# EAGLE design IRCHR_CTRL_J002942REVB (EAGLE 7.7.0)
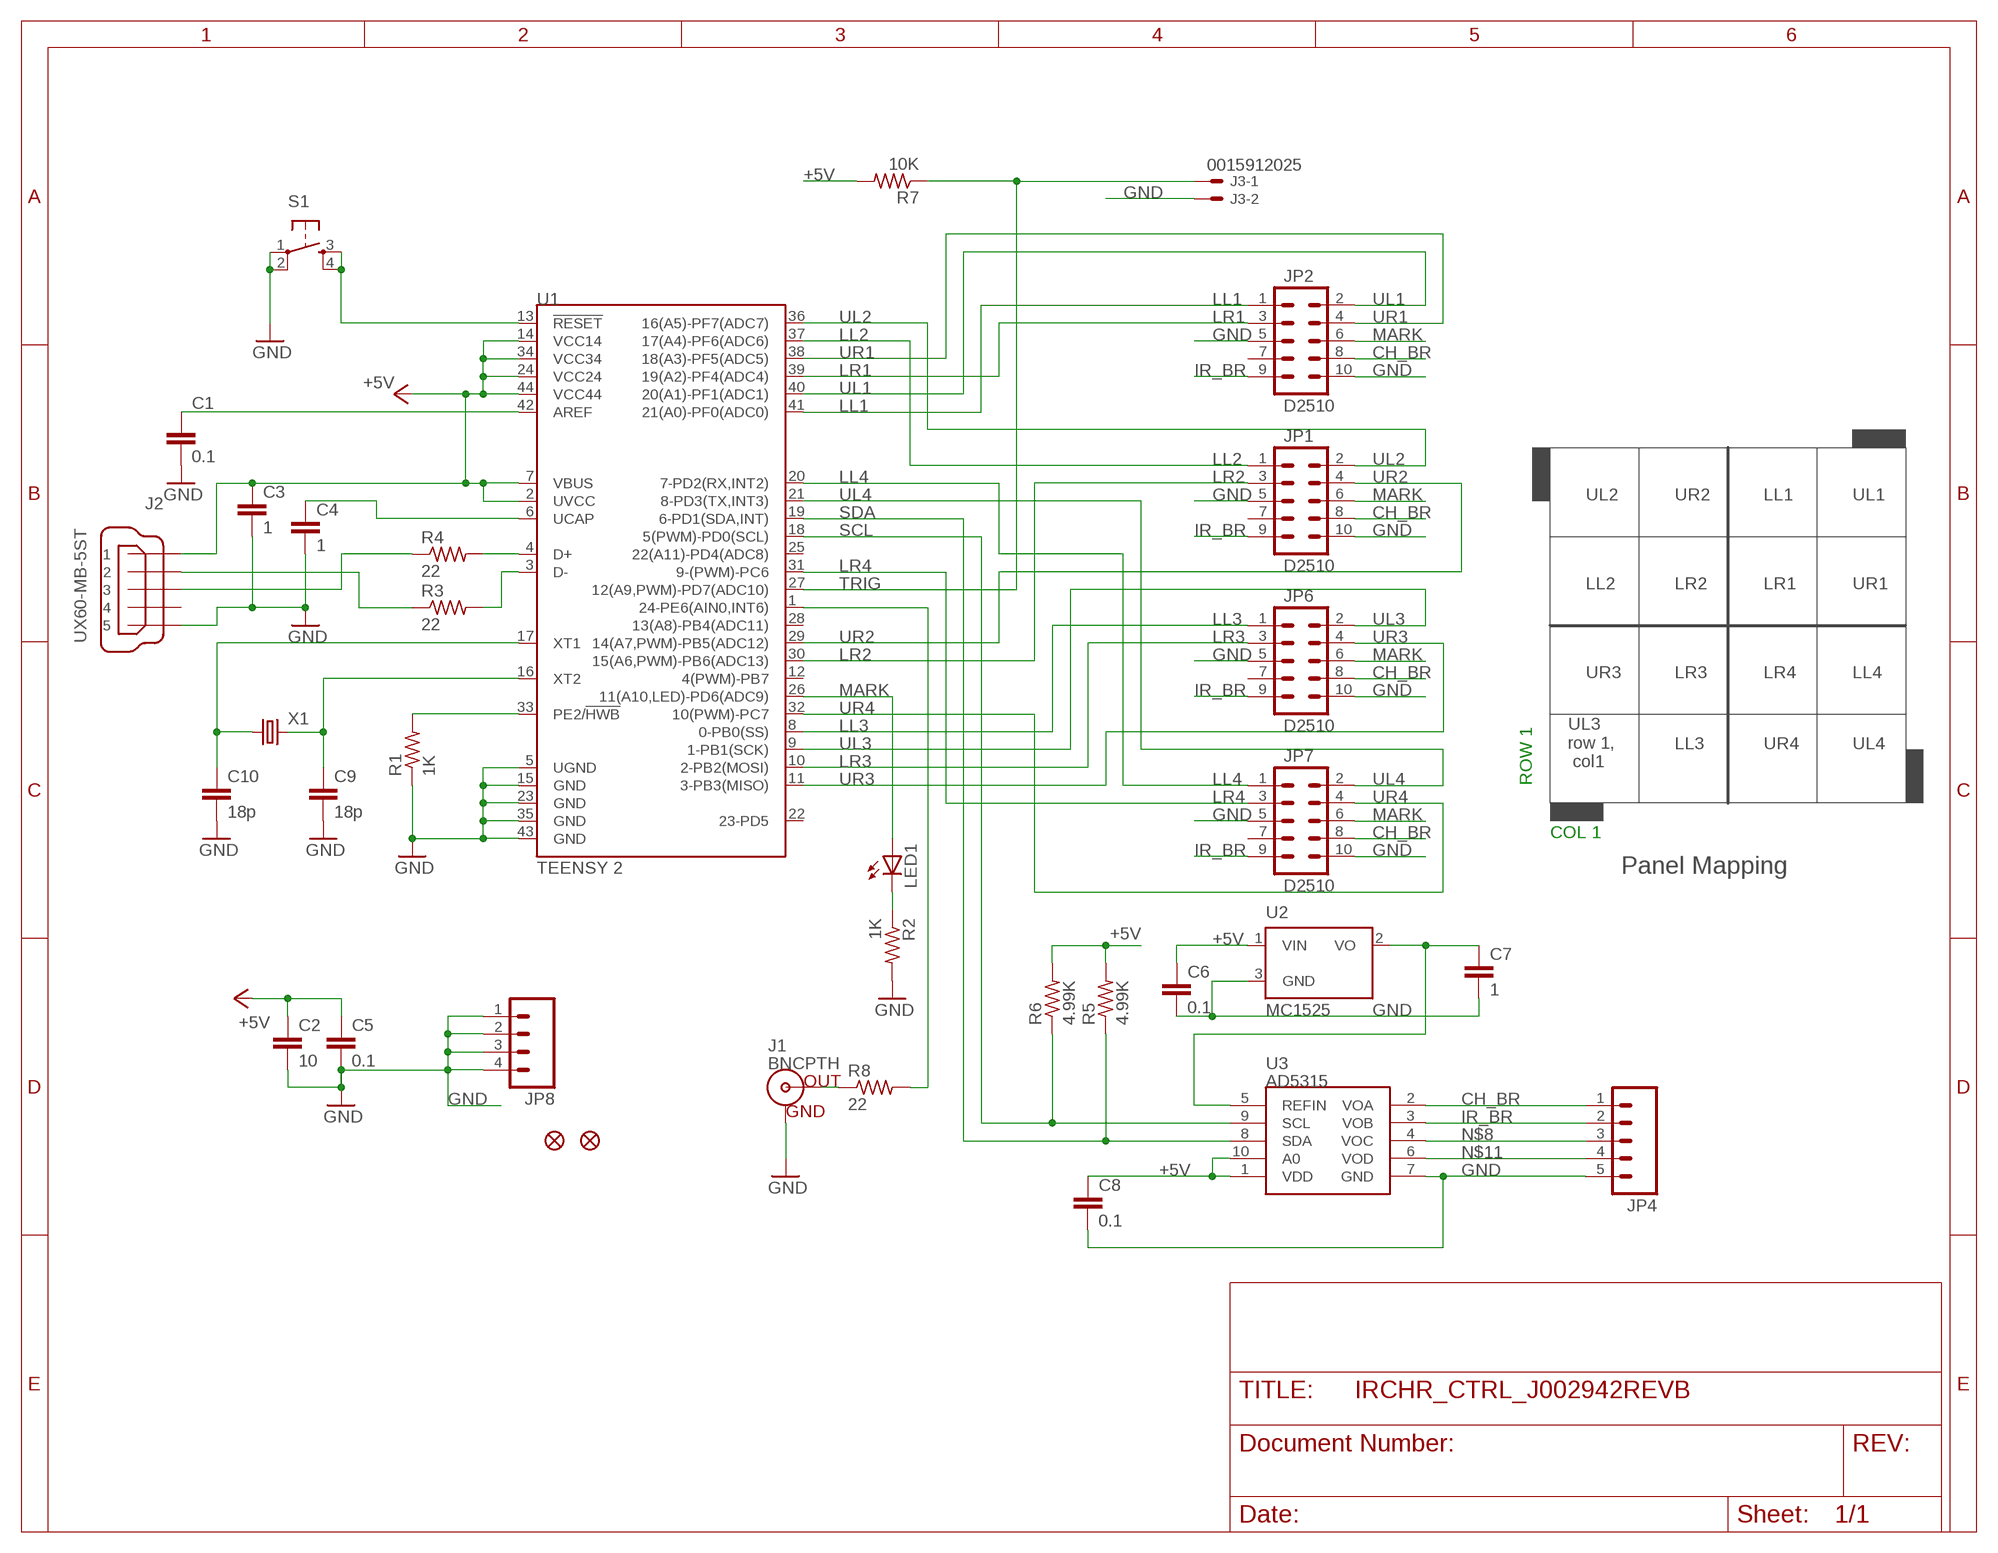
[diagram p0: schematic, sheet 1]

## Parts
C1  0.1  CAPS0805S  [0805S]
C2  10  CAPS1206S  [1206S]
C3  1  CAPS0805S  [0805S]
C4  1  CAPS0805S  [0805S]
C5  0.1  CAPS0805S  [0805S]
C6  0.1  CAPS0805S  [0805S]
C7  1  CAPS0805S  [0805S]
C8  0.1  CAPS0805S  [0805S]
C9  18p  CAPS0805S  [0805S]
C10  18p  CAPS0805S  [0805S]
J1  BNCPTH  [BNC]
J2  UX60-MB-5ST  MINI-USB-UX60-MB-5ST  [UX60-MB-5ST]
J3  0015912025  C-GRID-02-15-19  [15-91-02]
JP1  D2510  M05X22X5_SM_3M  [2X5-SHROUDED_SMD_3M]
JP2  D2510  M05X22X5_SM_3M  [2X5-SHROUDED_SMD_3M]
JP3  FIDUCIAL1X2.5  [FIDUCIAL-1X2.5]
JP4  M05LOCK  [1X05_LOCK]
JP5  FIDUCIAL1X2.5  [FIDUCIAL-1X2.5]
JP6  D2510  M05X22X5_SM_3M  [2X5-SHROUDED_SMD_3M]
JP7  D2510  M05X22X5_SM_3M  [2X5-SHROUDED_SMD_3M]
JP8  M04LOCK  [1X04_LOCK]
LED1  LEDCHIP-LED0805  [CHIP-LED0805]
R1  1K  RESISTOR_SM0805S  [0805S]
R2  1K  RESISTOR_SM0805S  [0805S]
R3  22  RESISTOR_SM0805S  [0805S]
R4  22  RESISTOR_SM0805S  [0805S]
R5  4.99K  RESISTOR_SM0805S  [0805S]
R6  4.99K  RESISTOR_SM0805S  [0805S]
R7  10K  RESISTOR_SM0805S  [0805S]
R8  22  RESISTOR_SM0805S  [0805S]
S1  TAC_SWITCHSMD  [TACTILE_SWITCH_SMD]
U1  TEENSY 2  TEENSY_CHIP  [SPARKFUN-DIGITALIC_TQFP44]
U2  MC1525  MC1525TT  [SOT23]
U3  AD5315  DAC_AD53X5  [MSOP10]
X1  CRYSTALCTS406  [CTS406]

## Nets
+5V: C2.1 C3.1 C5.1 C6.1 C8.1 J2.1 R5.2 R6.2 R7.2 U1.2(UVCC) U1.7(VBUS) U1.14(VCC14) U1.24(VCC24) U1.34(VCC34) U1.44(VCC44) U2.1(VIN) U3.1(VDD) U3.10(A0)
CH_BR: JP1.8 JP2.8 JP4.1 JP6.8 JP7.8 U3.2(VOA)
GND: C1.2 C2.2 C3.2 C4.2 C5.2 C6.2 C7.2 C8.2 C9.2 C10.2 J1.GND J2.5 J3.2 JP1.5 JP1.10 JP2.5 JP2.10 JP4.5 JP6.5 JP6.10 JP7.5 JP7.10 JP8.1 JP8.2 JP8.3 JP8.4 R1.1 R2.2 S1.1 S1.2 U1.5(UGND) U1.15(GND) U1.23(GND) U1.35(GND) U1.43(GND) U2.3(GND) U3.7(GND)
IR_BR: JP1.9 JP2.9 JP4.2 JP6.9 JP7.9 U3.3(VOB)
LL1: JP2.1 U1.41(21(A0)-PF0(ADC0))
LL2: JP1.1 U1.37(17(A4)-PF6(ADC6))
LL3: JP6.1 U1.8(0-PB0(SS))
LL4: JP7.1 U1.20(7-PD2(RX,INT2))
LR1: JP2.3 U1.39(19(A2)-PF4(ADC4))
LR2: JP1.3 U1.30(15(A6,PWM)-PB6(ADC13))
LR3: JP6.3 U1.10(2-PB2(MOSI))
LR4: JP7.3 U1.31(9-(PWM)-PC6)
MARK: JP1.6 JP2.6 JP6.6 JP7.6 LED1.A U1.26(11(A10,LED)-PD6(ADC9))
N$5: R3.2 U1.3(D-)
N$6: R4.2 U1.4(D+)
N$7: S1.3 S1.4 U1.13(!RESET)
N$8: JP4.3 U3.4(VOC)
N$9: R8.2 U1.1(24-PE6(AIN0,INT6))
N$10: J1.S(OUT) R8.1
N$11: JP4.4 U3.6(VOD)
N$12: C7.1 U2.2(VO) U3.5(REFIN)
N$14: C10.1 U1.17(XT1) X1.1
N$15: C9.1 U1.16(XT2) X1.3
N$16: R1.2 U1.33(PE2/!HWB)
N$20: C1.1 U1.42(AREF)
N$28: J2.2 R3.1
N$29: J2.3 R4.1
N$30: LED1.C R2.1
N$32: C4.1 U1.6(UCAP)
SCL: R6.1 U1.18(5(PWM)-PD0(SCL)) U3.9(SCL)
SDA: R5.1 U1.19(6-PD1(SDA,INT)) U3.8(SDA)
TRIG: J3.1 R7.1 U1.27(12(A9,PWM)-PD7(ADC10))
UL1: JP2.2 U1.40(20(A1)-PF1(ADC1))
UL2: JP1.2 U1.36(16(A5)-PF7(ADC7))
UL3: JP6.2 U1.9(1-PB1(SCK))
UL4: JP7.2 U1.21(8-PD3(TX,INT3))
UR1: JP2.4 U1.38(18(A3)-PF5(ADC5))
UR2: JP1.4 U1.29(14(A7,PWM)-PB5(ADC12))
UR3: JP6.4 U1.11(3-PB3(MISO))
UR4: JP7.4 U1.32(10(PWM)-PC7)
Unconnected: J2.4 JP1.7 JP2.7 JP6.7 JP7.7 U1.12(4(PWM)-PB7) U1.22(23-PD5) U1.25(22(A11)-PD4(ADC8)) U1.28(13(A8)-PB4(ADC11))

## Notes on the sheet
- UL2 | UR2 | LL1 | UL1
- LL2 | LR2 | LR1 | UR1
- UR3 | LR3 | LR4 | LL4
- LL3 | UR4 | UL4
- UL3
  row 1,
   col1
- ROW 1
- COL 1
- Panel Mapping

## Library data of the parts
C1 C3-C10 = STEVES_BU:CAPS
C2 = STEVES:CAPS
J1 = SparkFun:BNC: BNC Connector, Mouser Part# 5227161
J2 = STEVES_BU:MINI-USB-: MINI USB Connector Source: http://www.hirose.co.jp/cataloge_hp/e24000019.pdf; OC_FARNELL: unknown; OC_NEWARK: unknown
J3 = con-molex:C-GRID-02: CONNECTOR wire to board 2.54 mm (0.100") pitch header; OC_FARNELL: unknown; OC_NEWARK: unknown
JP1 JP2 JP6 JP7 = SparkFun:M05X2: Header 5x2 Standard 10-pin dual row 0.1" header. Commonly used with AVR-ISP. Use with Spark Fun Electronics SKU: PRT-00778
JP3 JP5 = SparkFun:FIDUCIAL: Fiducial Alignment Points Various fiducial points for machine vision alignment.
JP4 = SparkFun:M05: Header 5 Standard 5-pin 0.1" header. Use with straight break away headers (SKU : PRT-00116), right angle break away headers (PRT-00553), swiss pins (PRT-00743), machine pins (PRT-00117), and female headers (PRT-00115). Molex polarized connector foot print use with SKU : PRT-08230 with associated crimp pins and housings.
JP8 = SparkFun:M04: Header 4 Standard 4-pin 0.1" header. Use with straight break away headers (SKU : PRT-00116), right angle break away headers (PRT-00553), swiss pins (PRT-00743), machine pins (PRT-00117), and female headers (PRT-00115). Molex polarized connector foot print use with SKU : PRT-08231 with associated crimp pins and housings.
LED1 = led1:LED: LED OSRAM: - CHIPLED LG R971, LG N971, LY N971, LG Q971, LY Q971, LO R971, LY R971 LH N974, LH R974 LS Q976, LO Q976, LY Q976 LO Q996 - Hyper CHIPLED LW Q18S LB Q993, LB Q99A, LB R99A - SideLED LS A670, LO A670, LY A670, LG A670, LP A670 LB A673, LV A673, LT A673, LW A673 LH A674 LY A675 LS A676, LA A676, LO A676, LY A676, LW A676 LS A679, LY A679, LG A679 - Hyper Micro SIDELED® LS Y876, LA Y876, LO Y876, LY Y876 LT Y87S - SmartLED LW L88C, LW L88S LB L89C, LB L89S, LG L890 LS L89K, LO L89K, LY L89K LS L896, LA L896, LO L896, LY L896 - TOPLED LS T670, LO T670, LY T670, LG T670, LP T670 LSG T670, LSP T670, LSY T670, LOP T670, LYG T670 LG T671, LOG T671, LSG T671 LB T673, LV T673, LT T673, LW T673 LH T674 LS T676, LA T676, LO T676, LY T676, LB T676, LH T676, LSB T676, LW T676 LB T67C, LV T67C, LT T67C, LS T67K, LO T67K, LY T67K, LW E67C LS E67B, LA E67B, LO E67B, LY E67B, LB E67C, LV E67C, LT E67C LW T67C LS T679, LY T679, LG T679 LS T770, LO T770, LY T770, LG T770, LP T770 LB T773, LV T773, LT T773, LW T773 LH T774 LS E675, LA E675, LY E675, LS T675 LS T776, LA T776, LO T776, LY T776, LB T776 LHGB T686 LT T68C, LB T68C - Hyper Mini TOPLED® LB M676 - Mini TOPLED Santana® LG M470 LS M47K, LO M47K, LY M47K Source: http://www.osram.convergy.de LUXEON: - LUMILED® LXK2-PW12-R00, LXK2-PW12-S00, LXK2-PW14-U00, LXK2-PW14-V00 LXK2-PM12-R00, LXK2-PM12-S00, LXK2-PM14-U00 LXK2-PE12-Q00, LXK2-PE12-R00, LXK2-PE12-S00, LXK2-PE14-T00, LXK2-PE14-U00 LXK2-PB12-K00, LXK2-PB12-L00, LXK2-PB12-M00, LXK2-PB14-N00, LXK2-PB14-P00, LXK2-PB14-Q00 LXK2-PR12-L00, LXK2-PR12-M00, LXK2-PR14-Q00, LXK2-PR14-R00 LXK2-PD12-Q00, LXK2-PD12-R00, LXK2-PD12-S00 LXK2-PH12-R00, LXK2-PH12-S00 LXK2-PL12-P00, LXK2-PL12-Q00, LXK2-PL12-R00 Source: www.luxeon.com KINGBRIGHT: KA-3528ASYC Source: www.kingbright.com
R1-R8 = STEVES_BU:RESISTOR_SM
S1 = SparkFun:TAC_SWITCH: Momentary Switch Button commonly used for reset or general input. Spark Fun Electronics SKU : COM-00097
U1 = SparkFun-DigitalIC:TEENSY_CHIP
U2 = microchip:MC15*: 2.5V and 4.096V Voltage References Source: http://www.microchip.com .. 21653b.pdf; OC_FARNELL: unknown; OC_NEWARK: unknown
U3 = STEVES_BU:DAC_AD53X5
X1 = crystal:CRYSTAL: CRYSTAL; OC_FARNELL: unknown; OC_NEWARK: unknown

## Board
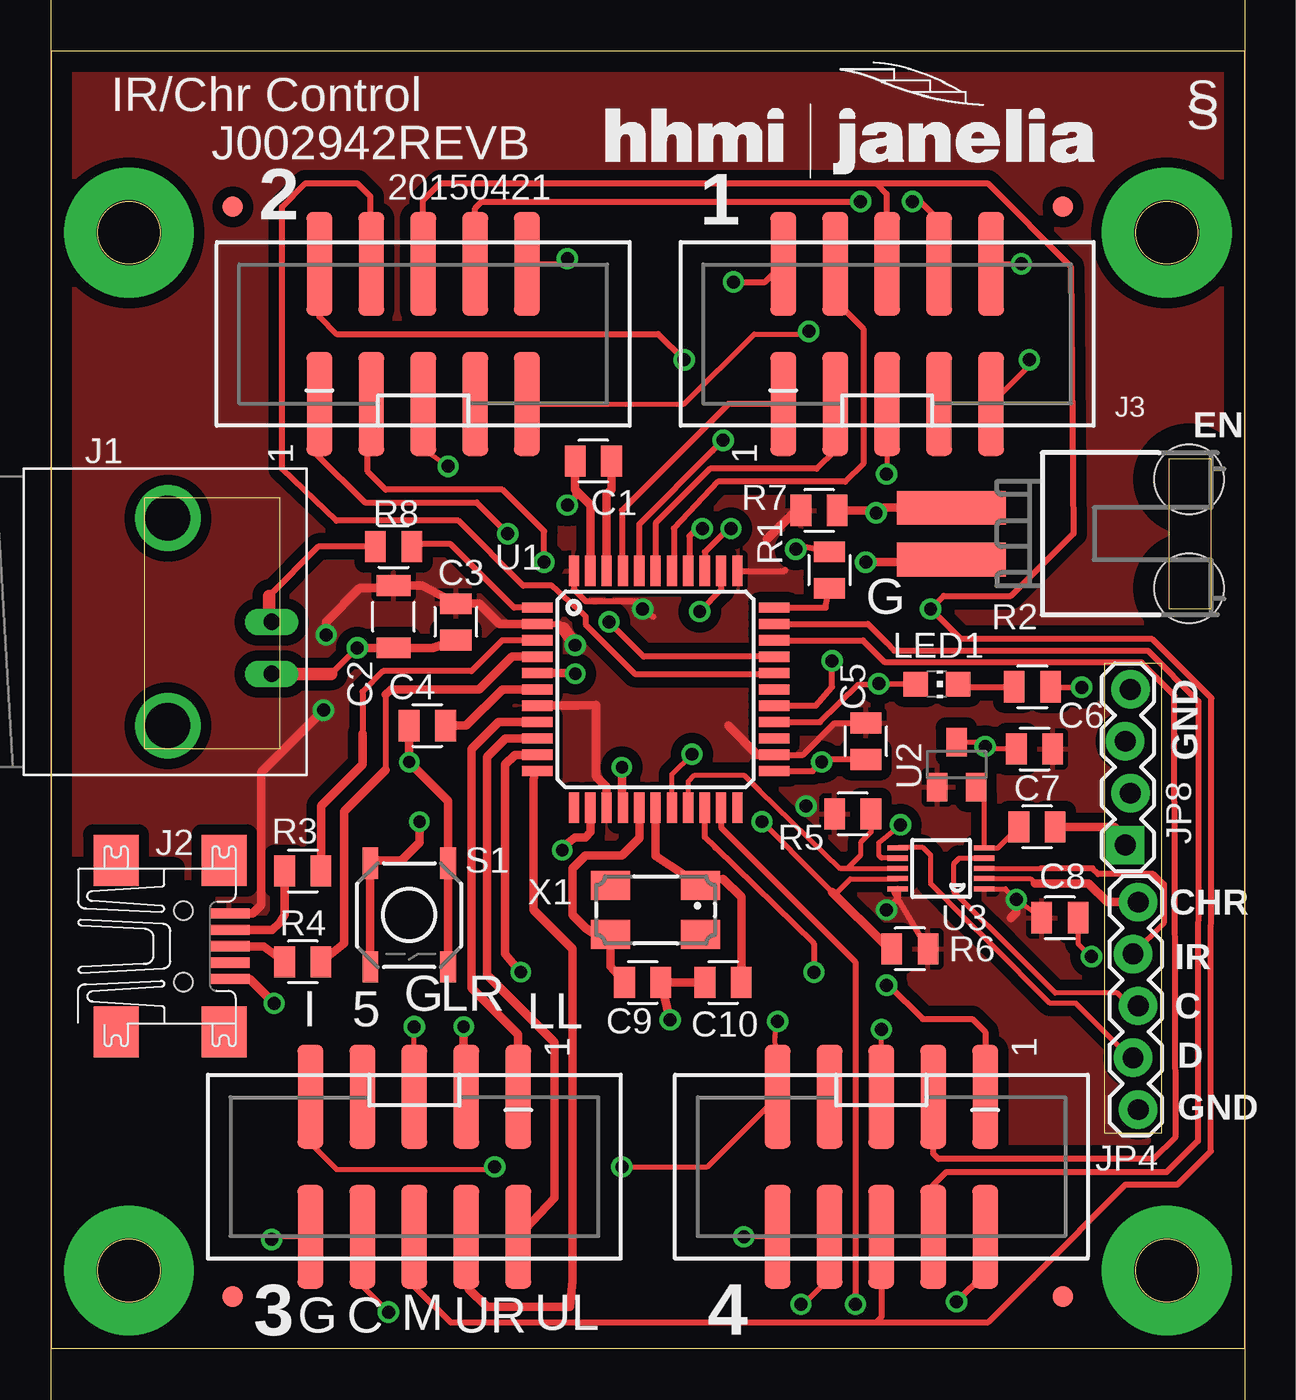
[diagram p1: board, top side]
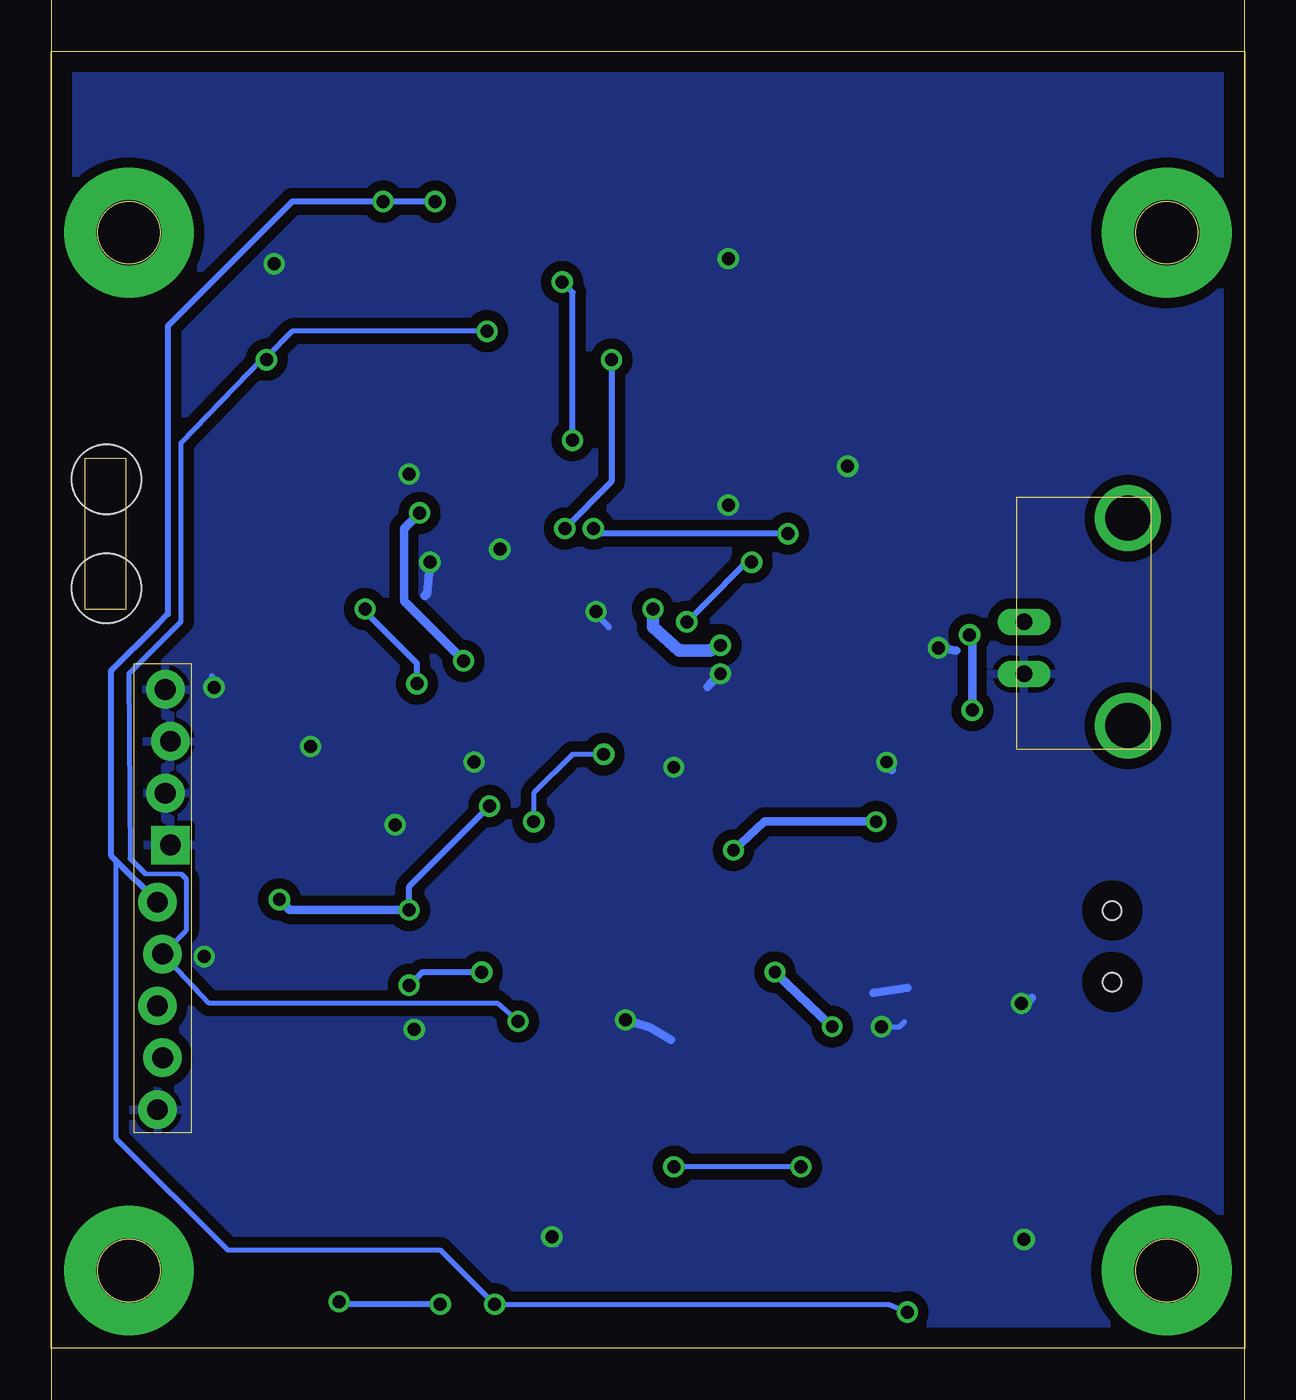
[diagram p2: board, bottom side, seen from below]

Size 58.42 x 63.5 mm. Coordinates in mm from the lower left corner, seen from the top.
Outline: 0,0 58.42,0 58.42,63.5 0,63.5 0,0
Copper layers (1*16): Top 0.035mm / dielectric 1.5mm / Bottom 0.035mm
Design rules "default *": minimum track width 8mil, minimum drill 17mil, track to track 8mil, track to pad 8mil, pad to pad 8mil, via to via 8mil, smd to smd 8mil, copper to edge 40mil, drill to drill 8mil, minimum pad ring 10mil, minimum via ring 8mil, stop-mask expansion 4mil, vias tented up to drill 25mil, thermal gap 10mil
Milling: area 2.3,53.1 to 5.3,56.1; area 53.1,53.1 to 56.1,56.1; area 53.1,2.3 to 56.1,5.3; area 2.3,2.3 to 5.3,5.3; area 63.2,53.1 to 66.3,56.1; area 114,53.1 to 117.1,56.1; area 114,2.3 to 117.1,5.3; area 63.2,2.3 to 66.3,5.3; 36 lines

### Footprints (pad centres in the part's own frame; a part is rotated, then mirrored left to right if it is on the bottom)
0805S = smd 1.016 x 1.524: 1 -0.889,0; 2 0.889,0
1206S = smd 1.016 x 1.651: 1 -1.524,0; 2 1.524,0
BNC = drill 2.2: 3 -5.08,5.08; 4 5.08,5.08 | drill 0.8 long: GND -2.54,0; S 0,0
UX60-MB-5ST = smd 2 x 0.5: 1 2.25,1.6; 2 2.25,0.8; 3 2.25,0; 4 2.25,-0.8; 5 2.25,-1.6 | smd 2.2 x 2.5: M1 -3.3,-4.2; M2 -3.3,4.2; M3 2,4.2; M4 2,-4.2 | hole 0.9: 0,-1.75; 0,1.75
15-91-02 = smd 1.651 x 5.334: 1 -1.27,-10.795; 2 1.27,-10.795 | hole 3.404: -2.667,0.838; 2.667,0.838
2X5-SHROUDED_SMD_3M = smd 5.08 x 1.27: 1 -3.429,5.08; 2 3.429,5.08; 3 -3.429,2.54; 4 3.429,2.54; 5 -3.429,0; 6 3.429,0; 7 -3.429,-2.54; 8 3.429,-2.54; 9 -3.429,-5.08; 10 3.429,-5.08
FIDUCIAL-1X2.5 = smd 1 x 1: 1 0,0
1X05_LOCK = drill 1.016 pad 1.88: 1 0,0.127; 2 2.54,-0.127; 3 5.08,0.127; 4 7.62,-0.127; 5 10.16,0.127
1X04_LOCK = drill 1.016 pad 1.88 square: 1 0,0.127 | drill 1.016 pad 1.88: 2 2.54,-0.127; 3 5.08,0.127; 4 7.62,-0.127
CHIP-LED0805 = smd 1.2 x 1.2: A 0,-1.05; C 0,1.05
TACTILE_SWITCH_SMD = smd 1.524 x 0.762: 1 -2.54,1.905; 2 2.54,1.905; 3 -2.54,-1.905; 4 2.54,-1.905
SPARKFUN-DIGITALIC_TQFP44 = smd 1.5 x 0.5: 1 -5.8,4; 2 -5.8,3.2; 3 -5.8,2.4; 4 -5.8,1.6; 5 -5.8,0.8; 6 -5.8,0; 7 -5.8,-0.8; 8 -5.8,-1.6; 9 -5.8,-2.4; 10 -5.8,-3.2; 11 -5.8,-4; 23 5.8,-4; 24 5.8,-3.2; 25 5.8,-2.4; 26 5.8,-1.6; 27 5.8,-0.8; 28 5.8,0; 29 5.8,0.8; 30 5.8,1.6; 31 5.8,2.4; 32 5.8,3.2; 33 5.8,4 | smd 0.5 x 1.5: 12 -4,-5.8; 13 -3.2,-5.8; 14 -2.4,-5.8; 15 -1.6,-5.8; 16 -0.8,-5.8; 17 0,-5.8; 18 0.8,-5.8; 19 1.6,-5.8; 20 2.4,-5.8; 21 3.2,-5.8; 22 4,-5.8; 34 4,5.8; 35 3.2,5.8; 36 2.4,5.8; 37 1.6,5.8; 38 0.8,5.8; 39 0,5.8; 40 -0.8,5.8; 41 -1.6,5.8; 42 -2.4,5.8; 43 -3.2,5.8; 44 -4,5.8
SOT23 = smd 1 x 1.4: 1 -0.95,-1.1; 2 0.95,-1.1; 3 0,1.1
MSOP10 = smd 0.25 x 1: 1 -1,-2.113; 2 -0.5,-2.113; 3 0,-2.113; 4 0.5,-2.113; 5 1,-2.113; 6 1,2.113; 7 0.5,2.113; 8 0,2.113; 9 -0.5,2.113; 10 -1,2.113
CTS406 = smd 1.9 x 1.4: 1 -2.2,-1.2; 2 2.2,-1.2; 3 2.2,1.2; 4 -2.2,1.2

### Placement (x,y rotation side)
C1  26.54,43.43 180 top
C2  16.76,35.81 270 top
C3  19.81,35.56 270 top
C4  18.41,30.48 180 top
C5  39.88,29.72 270 top
C6  48.13,29.34 180 top
C7  48.26,25.53 0 top
C8  49.38,21.08 0 top
C9  28.96,17.91 0 top
C10  32.89,17.91 180 top
J1  10.79,35.56 90 top
J2  6.48,19.68 0 top
J3  54.86,39.88 270 top
JP1  18.22,49.66 90 top
JP2  40.92,49.66 90 top
JP3  49.53,55.88 0 top
JP4  53.09,21.84 270 top
JP5  49.53,2.54 0 top
JP6  17.78,8.89 270 top
JP7  40.64,8.89 270 top
JP8  52.7,24.64 90 top
JP9  FIDUCIAL1X2.5  [FIDUCIAL-1X2.5]  8.89,55.88 0 top
JP10  FIDUCIAL1X2.5  [FIDUCIAL-1X2.5]  8.89,2.54 0 top
LED1  43.36,32.51 270 top
R1  38.1,38.1 270 top
R2  48.03,32.38 0 top
R3  12.32,23.37 0 top
R4  12.32,18.92 0 top
R5  39.24,26.16 180 top
R6  42.04,19.56 0 top
R7  37.59,41.02 180 top
R8  16.76,39.24 0 top
S1  17.53,21.21 270 top
U1  29.59,32.26 0 top
U2  44.32,28.57 0 top
U3  43.56,23.5 90 top
U$1  JFRC-LOGOLOGO_JANELIA_2014  [LOGO_JANELIA_2014]  26.54,57.4 0 top
X1  29.59,21.46 180 top

### Tracks (layer width: path | path; a pad name or v marks a point on that pad's centre or on a via)
+5V  (via drill 0.64)
  Top 0.254: U3.1 46.72,22.5 v47.24,21.97 C8.1
  Top 0.305: U1.24 36.8,29.06 38.35,30.61 C5.1 | U1.34 35.9,38.06 35.94,38.1 | U1.44 25.59,37.15 26.16,36.58 28.7,36.58 v28.96,36.2 29.46,35.81 | 23.55,35.46 24.87,35.46 25.08,35.24 v25.65,34.42 | R6.2 41.27,22.32 U3.10 41.45,22.02 v40.89,21.46 | v36.96,26.54 36.96,26.29
  Top 0.406: U1.14 27.18,27.49 26.67,28 26.67,28.7 26.67,31.5 25.82,31.46 U1.7 | U1.2 23.55,35.46 21.95,35.46 20.95,36.45 C3.1 18.16,37.34 C2.1 16.64,37.21 15.11,37.21 13.46,35.56 v13.46,34.92 | U1.24 34.57,29.06 33.15,30.48 | v47.24,21.97 47.24,21.34 46.99,21.08 | R7.2 36.45,41.02 35.05,39.62 | J2.1 9.86,21.29 10.29,21.72 10.29,28.19 v13.34,31.24
  Top 0.61: v25.65,34.42 25.08,35.24
  Bottom 0.305: v40.89,21.46 40.89,22.61 v36.96,26.54
  Bottom 0.406: v40.89,21.46 46.74,21.46 v47.24,21.97 | v13.34,31.24 13.34,34.8 v13.46,34.92
  Bottom 0.61: v28.96,36.2 28.96,35.31 27.69,34.16 26.16,34.16 v25.65,34.42
  pour Top (isolate 0.508): -1.02,58.8 -1.02,-0.76 60.83,-0.76 60.71,65.02 -1.14,65.02
CH_BR  (via drill 0.64)
  Top 0.254: v36.7,2.16 36.83,2.16 38.23,3.56 38.23,5.33 JP7.8 | v16.51,1.78 15.24,3.05 JP6.8 | U3.2 47.92,23 48.16,22.76
  Top 0.305: JP1.8 20.76,55.81 21.08,56.13 v39.62,56.13 | v42.16,56.13 42.55,56.13 43.56,55.12 43.56,53.18 JP2.8
  Top 0.406: 48.16,22.76 50.77,22.76 51.69,21.84 JP4.1
  Bottom 0.254: 55.24,23.88 55.24,10.29 49.78,4.83 39.37,4.83 v36.7,2.16 17.4,2.16 v16.51,1.78
  Bottom 0.305: v39.62,56.13 v42.16,56.13 46.61,56.13 52.7,50.04 52.7,35.94 53.21,35.43 55.5,33.15 55.5,24.13 55.24,23.88 JP4.1
GND  (via drill 0.6, 0.64)
  Top 0.254: C8.2 50.27,19.81 v50.93,19.18 | JP6.10 10.92,5.46 v10.79,5.33 | JP7.10 v33.91,5.46 | JP2.10 v47.5,53.09 | JP1.10 25.02,53.09 v25.27,53.34 | JP1.5 18.22,44.01 v19.43,43.18 | JP2.5 40.92,43.53 v40.89,42.8 | JP6.5 v17.78,15.75 | C6.2 45.85,29.34 v45.72,29.46 45.51,29.68 U2.3 | U3.7 40.65,24 40.51,24.13 40.51,24.77 v41.58,25.63 | JP7.5 v40.64,15.62
  Top 0.305: U1.23 37.27,28.26 v37.72,28.7 37.85,28.83 C5.2 | R2.2 v50.44,32.36 | U1.35 32.79,37.11 v31.75,36.07 | 25.65,42.93 25.65,41.66 v25.27,41.27 | R1.1 36.2,39.37 v36.45,39.12 | 13.72,33.02 v14.99,34.29
  Top 0.406: C4.2 v17.53,28.7 19.43,26.8 S1.1 S1.2 | U1.5 25.74,33.06 v25.65,33.02 | U1.15 27.94,26.51 v27.94,28.45 | C10.2 30.35,17.91 C9.2 v30.3,16.08 | C3.2 18.67,34.29 C2.2 v14.99,34.29 | C1.2 25.65,42.93 25.65,42.04 26.42,41.27 26.42,38.08 U1.43 | J3.2 41.27,38.48 v39.88,38.48 | C7.2 52.07,25.53 JP8.1 | J2.5 9.73,18.09 v10.92,16.89
  Top 0.61: J1.GND 13.72,33.02
  Bottom 0.254: v50.93,19.18 50.67,19.18 | v10.79,5.33 10.79,4.95 | v33.91,5.46 33.91,5.33 33.66,5.08 | v47.5,53.09 47.62,53.09 | v25.27,53.34 25.4,53.21 | v19.43,43.18 19.43,43.31 19.18,43.05 | v17.78,15.75 16.89,15.75 16.64,16 | v45.72,29.46 45.34,29.46 | v41.58,25.63 41.27,25.4 41.4,25.27
  Bottom 0.305: v37.72,28.7 37.97,28.7 | v50.44,32.36 50.55,32.89 | v31.75,36.07 31.75,35.94 31.11,35.31 | v25.27,41.27 25.15,41.15 | v36.45,39.12 36.58,39.24
  Bottom 0.406: v17.53,28.7 17.65,28.7 17.27,28.32 | v25.65,33.02 26.16,32.51 26.29,32.38 | v27.94,28.45 27.94,28.7 27.81,28.7 | v30.3,16.08 29.11,15.72 28.07,15.11 | v14.99,34.29 14.1,34.16 | 16.51,17.65 18.16,17.4 | v39.88,38.48 40.01,36.96 40.13,36.83 | v10.92,16.89 10.41,17.14 10.79,16.64
  pour Bottom (isolate 0.508): -3.05,64.26 -3.05,-2.54 58.93,-2.54 58.93,64.26
IR_BR  (via drill 0.64)
  Top 0.254: 54.48,22.73 54.48,20.83 JP4.2 | JP6.9 12.7,10.03 13.97,8.76 21.59,8.76 v21.72,8.89 | v27.94,8.89 32.13,8.89 JP7.9 35.43,15.24 v35.56,16 | JP1.9 30.99,46.23 34.42,49.66 36.96,49.66 v37.08,49.78 | 47.88,48.1 JP2.9 | U3.3 48.46,23.5
  Top 0.305: 54.48,22.73 54.43,22.73 53.95,23.22 51.26,23.22 50.98,23.5 48.46,23.5
  Top 0.406: 47.88,48.1 v47.88,48.39
  Bottom 0.254: v21.72,8.89 v27.94,8.89 | v37.08,49.78 46.61,49.78 47.88,48.51 | v47.88,48.39 48.13,48.39 52.07,44.32 52.07,35.56 54.61,33.02 54.56,23.98 53.82,23.24 52.05,23.22 51.82,22.99 51.82,20.45 JP4.2 50.67,16.89 37.47,16.89 36.58,16.89 v35.56,16
  Bottom 0.406: 47.88,48.51 v47.88,48.39
LL1
  Top 0.305: JP2.1 33.15,46.23 27.94,41.02 27.94,38.11 U1.41
LL2  (via drill 0.64)
  Top 0.305: JP1.1 13.01,43.76 15.37,41.4 20.83,41.4 v22.35,39.88 | v31.88,40.13 31.88,40.39 31.24,39.75 31.24,38.11 U1.37
  Bottom 0.305: v22.35,39.88 31.5,39.88 v31.88,40.13
LL3
  Top 0.406: U1.8 21.89,30.66 20.57,29.34 20.57,17.65 22.86,15.37 22.86,13.71 JP6.1
LL4  (via drill 0.64)
  Top 0.305: U1.20 31.99,25.03 32.51,24.51 37.34,19.81 37.34,18.54 v37.34,18.41 | v40.89,17.78 41.02,17.78 42.67,16.13 45.09,16.13 45.72,15.49 JP7.1
  Bottom 0.305: v37.34,18.41 40.26,18.41 v40.89,17.78
LR1
  Top 0.305: JP2.3 38.38,43.97 37.47,43.05 32.26,43.05 29.59,40.39 U1.39
LR2  (via drill 0.64)
  Top 0.305: U1.30 29.01,33.86 v27.3,35.56 | v24.13,38.48 24.13,40.01 22.1,42.04 16.38,42.04 15.49,42.93 15.49,45.47 15.75,45.72 15.75,46.16 JP1.3
  Bottom 0.305: v27.3,35.56 26.54,36.32 24.38,38.48 v24.13,38.48
LR3  (via drill 0.6)
  Top 0.406: U1.10 22.71,29.06 22.23,28.57 22.23,19.3 v22.99,18.41 | v20.19,15.75 20.19,13.08 JP6.3
  Bottom 0.406: v22.99,18.41 v20.19,15.75
LR4
  Top 0.305: U1.31 39.74,34.66 40.36,34.04 40.82,33.58 50.67,33.58 53.37,33.58 54.99,31.95 54.99,30.07 55.04,10.36 53.95,9.27 43.43,9.27 43.18,9.53 JP7.3
MARK  (via drill 0.64)
  Top 0.305: JP1.6 18.22,56.19 19.05,57.02 40.39,57.02 | 40.39,57.02 40.89,56.52 40.89,53.12 JP2.6 | JP6.6 17.78,3.05 19.56,1.27 38.23,1.27 38.61,1.27 38.99,1.27 40.39,1.27 | JP7.6 40.64,3.56 40.64,1.52 40.39,1.27 | U1.26 37.64,30.66 39.52,32.49 | 39.52,32.49 v40.51,32.54 | v40.51,32.54 LED1.A | 40.39,57.02 45.85,57.02 49.91,52.96 50.04,39.88 46.99,36.83 43.69,36.83 v43.05,36.2 44.15,35.1 44.53,34.72 53.9,34.72 56.79,31.83 56.77,9.65 55.14,8.03 52.6,8.03 48.06,3.45 45.92,1.32 45.85,1.27 40.39,1.27 | 39.52,32.49 v40.51,32.54
  Bottom 0.305: v40.51,32.54 40.51,33.53 43.05,36.07 v43.05,36.2
N$1  (via drill 3.17 pad 6.35)
  other vias: 3.81,3.81
N$2  (via drill 3.17 pad 6.35)
  other vias: 54.61,3.81
N$3  (via drill 3.17 pad 6.35)
  other vias: 54.61,54.61
N$4  (via drill 3.17 pad 6.35)
  other vias: 3.81,54.61
N$5
  Top 0.305: U1.3 22.09,34.66 20.57,33.15 16.26,33.15 15.24,32.13 15.24,30.1
  Top 0.406: R3.2 13.21,26.54 15.24,28.57 15.24,30.1
N$6
  Top 0.305: 16.38,32 16.38,28.32
  Top 0.406: U1.4 22.55,33.86 20.95,32.26 16.64,32.26 16.38,32 | R4.2 14.35,19.81 14.35,21.34 14.35,26.29 16.38,28.32
N$7  (via drill 0.6)
  Top 0.406: U1.13 26.42,26.43 26.42,25.27 26.16,25.02 25.65,25.02 25.02,24.51 v25.02,24.38 | S1.4 S1.3 15.75,23.88 17.14,23.88 18.03,24.77 v18.03,25.78
  Bottom 0.406: v25.02,24.38 23.5,25.78 v18.03,25.78
N$8
  Top 0.254: JP4.3 52.83,16.76 52.2,17.4 49.15,17.4 46.74,19.81 44.96,21.59 44.2,22.35 44.2,23.75 44.45,24 U3.4
N$9
  Top 0.305: U1.1 22.67,36.26 19.56,39.37 17.78,39.37 R8.2
N$10
  Top 0.305: R8.1 13.08,39.24 10.67,36.83 | 10.67,35.94 J1.S
  Top 0.61: 10.67,36.83 10.67,35.94
N$11
  Top 0.254: JP4.4 52.83,14.22 50.16,16.89 48.9,16.89 45.97,19.81 44.7,21.08 43.05,22.73 43.05,24.13 42.67,24.51 41.46,24.51 U3.6
N$12
  Top 0.254: C7.1 46.34,24.5 U3.5 45.67,27.07 U2.2
N$14
  Top 0.406: U1.17 29.59,24.1 X1.1 31.44,22.92 32.89,22.99 33.78,22.1 C10.1
N$15
  Top 0.406: U1.16 28.79,24.98 27.94,24.13 26.16,24.13 25.53,23.5 25.53,21.21 26.16,20.57 26.56,20.32 X1.3 27.39,18.71 C9.1
N$16
  Top 0.305: U1.33 37.91,36.26 R1.2
N$20
  Top 0.406: C1.1 27.43,42.04 27.18,41.78 27.18,38.07 U1.42
N$28
  Top 0.406: J2.2 10.83,20.48 11.18,20.83 11.43,21.21 R3.1
N$29
  Top 0.406: J2.3 10.41,19.68 R4.1
N$30
  Top 0.305: LED1.C 44.83,32.51 44.96,32.38 R2.1
N$32
  Top 0.406: U1.6 22.1,32.26 20.32,30.48 19.18,30.48 C4.1
SCL  (via drill 0.64)
  Top 0.254: U1.18 30.39,28.11 v31.37,29.08 | v34.8,25.78 37.59,22.99 38.23,22.35 38.48,22.35 39.12,22.99 41.44,22.99 U3.9
  Top 0.406: R6.1 40.77,19.81 38.23,22.35
  Bottom 0.254: v31.37,29.08 32.89,29.08 34.8,27.18 v34.8,25.78
SDA
  Top 0.254: U1.19 31.19,27.76 31.5,28.07 33.91,28.07 34.67,27.3 38.61,23.5 | 38.61,23.5 U3.8 | R5.1 40.13,25.4 40.13,25.27 39.62,24.77 39.62,24.13 38.99,23.5 38.61,23.5
TRIG  (via drill 0.64)
  Top 0.305: U1.27 37.43,31.46 38.23,32.38 v38.23,33.66
  Top 0.406: J3.1 40.51,41.15 40.39,41.02 v40.39,40.89 40.26,41.02 R7.1
  Bottom 0.406: v38.23,33.66 38.35,33.78 41.15,36.58 41.15,40.13 v40.39,40.89
UL1  (via drill 0.64)
  Top 0.305: U1.40 28.79,40.35 32.38,43.94 v32.89,44.45 | v33.4,52.2 34.95,52.2 JP2.2
  Bottom 0.305: v32.89,44.45 32.89,51.69 v33.4,52.2
UL2  (via drill 0.64)
  Top 0.305: JP1.2 13.14,50.49 13.97,49.66 29.72,49.66 v30.99,48.39 | v33.27,40.13 33.15,40.13 32,38.99 32,38.07 U1.36
  Bottom 0.305: v30.99,48.39 30.99,42.42 v33.27,40.13
UL3
  Top 0.406: U1.9 22.24,29.86 21.34,28.96 21.34,18.29 24.13,15.49 24.64,14.99 24.64,7.37 JP6.2
UL4  (via drill 0.64)
  Top 0.305: U1.21 32.79,25.5 39.37,18.92 39.37,2.67 v39.37,2.16 | JP7.2 45.72,3.68 v44.32,2.29
  Bottom 0.305: v39.37,2.16 44.2,2.16 v44.32,2.29
UR1
  Top 0.305: JP2.4 38.38,51.28 39.75,49.91 39.75,43.31 38.86,42.42 32.64,42.42 30.48,40.13 30.48,38.15 U1.38
UR2
  Top 0.305: JP1.4 15.62,53.14 15.62,56.39 14.99,57.02 12.45,57.02 11.3,55.88 11.3,43.05 13.97,40.51 19.94,40.51 23.11,37.34 24.51,37.34 25.65,36.32 26.16,35.81 26.16,35.43 28.57,33.02 35.35,33.02 U1.29
UR3
  Top 0.406: U1.11 23.69,28.26 23.62,27.81 23.62,21.46 25.53,19.56 25.53,15.49 25.53,3.3 25.4,2.03 21.34,2.03 20.45,2.92 JP6.4
UR4
  Top 0.305: U1.32 39.98,35.46 40.87,34.57 40.89,34.54 41.27,34.14 53.7,34.14 56.16,31.67 56.13,10.16 54.61,8.64 54.1,8.64 43.81,8.64 43.18,8 JP7.4

### Text on the board
tPlace: S | IR/Chr Control | S | J002942REVB | 20150421 | 2 | 1 | EN | G | GND | CHR | IR | G | LR | I | 5 | LL | C | D | GND | 3 | G | C | M | UR | UL | 4